# Altium project CAN_Breakout-Board.PrjPcb
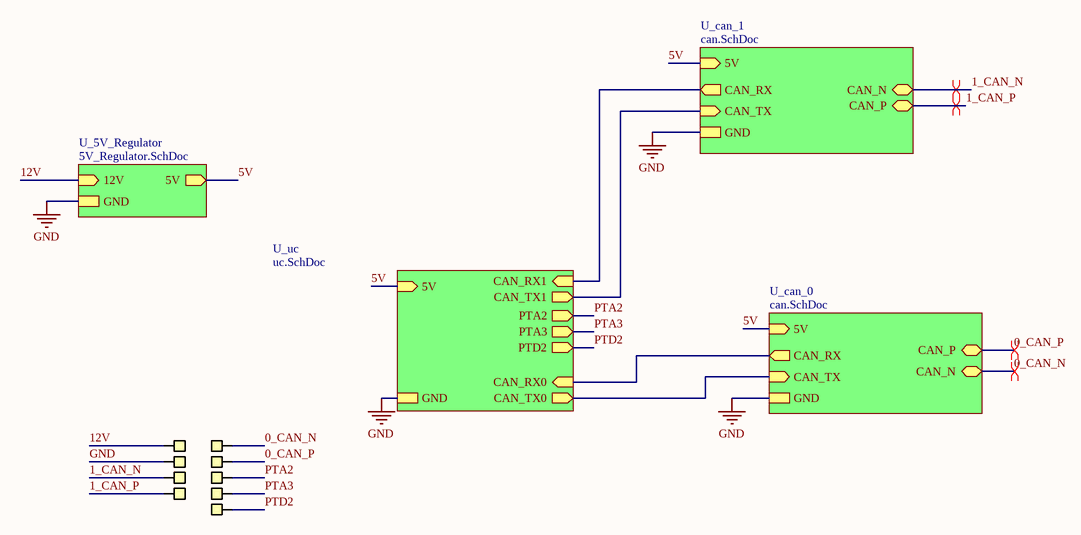
[diagram p0: Top_Level.SchDoc]
4 sheets, 47 parts. Net scope: hierarchical (ports join the sheet entries above them; power ports are global).
Board file: CAN_Breakout-Board.PcbDoc
Sheets:
  Top_Level.SchDoc
    U_5V_Regulator = 5V_Regulator.SchDoc
    U_can_1 = can.SchDoc
    U_uc = uc.SchDoc
    U_can_0 = can.SchDoc

## Sheet Top_Level.SchDoc
size A; SheetNumber: 1; SheetTotal: 4

### Parts
X1  GenericPinHeader(0.1in)  [GenericPinHeader(.1in)]  (value not drawn)
X2  GenericPinHeader(0.1in)  [GenericPinHeader(.1in)]  (value not drawn)
X3  GenericPinHeader(0.1in)  [GenericPinHeader(.1in)]  (value not drawn)
X4  GenericPinHeader(0.1in)  [GenericPinHeader(.1in)]  (value not drawn)
X5  GenericPinHeader(0.1in)  [GenericPinHeader(.1in)]  (value not drawn)
X6  GenericPinHeader(0.1in)  [GenericPinHeader(.1in)]  (value not drawn)
X7  GenericPinHeader(0.1in)  [GenericPinHeader(.1in)]  (value not drawn)
X8  GenericPinHeader(0.1in)  [GenericPinHeader(.1in)]  (value not drawn)
X9  GenericPinHeader(0.1in)  [GenericPinHeader(.1in)]  (value not drawn)

### Sub-sheets
U_5V_Regulator = 5V_Regulator.SchDoc: 5V (out), 12V (in), GND
U_can_0 = can.SchDoc: 5V (in), CAN_P (bidir), CAN_N (bidir), CAN_TX (in), CAN_RX (out), GND
U_can_1 = can.SchDoc: 5V (in), CAN_P (bidir), CAN_N (bidir), CAN_TX (in), CAN_RX (out), GND
U_uc = uc.SchDoc: 5V (in), CAN_TX1 (out), CAN_RX1 (in), CAN_TX0 (out), CAN_RX0 (in), PTA2 (out), PTA3 (out), PTD2 (out), GND

### Nets
GND: X3.1(Pin) ; sheet U_5V_Regulator/GND, sheet U_can_1/GND, sheet U_uc/GND, sheet U_can_0/GND
0_CAN_N: X2.1(Pin) ; sheet U_can_0/CAN_N
0_CAN_P: X4.1(Pin) ; sheet U_can_0/CAN_P
1_CAN_N: X5.1(Pin) ; sheet U_can_1/CAN_N
1_CAN_P: X7.1(Pin) ; sheet U_can_1/CAN_P
5V: sheet U_5V_Regulator/5V, sheet U_can_1/5V, sheet U_uc/5V, sheet U_can_0/5V
12V: X1.1(Pin) ; sheet U_5V_Regulator/12V
PTA2: X6.1(Pin) ; sheet U_uc/PTA2
PTA3: X8.1(Pin) ; sheet U_uc/PTA3
PTD2: X9.1(Pin) ; sheet U_uc/PTD2
NetU2#1_20: sheet U_uc/CAN_TX0, sheet U_can_0/CAN_TX
NetU2#1_21: sheet U_uc/CAN_RX0, sheet U_can_0/CAN_RX
NetU2#1_51: sheet U_can_1/CAN_TX, sheet U_uc/CAN_TX1
NetU2#1_52: sheet U_can_1/CAN_RX, sheet U_uc/CAN_RX1

### Layout directives
differential pair: 0_CAN_N, 0_CAN_P, 1_CAN_N, 1_CAN_P

### Library data of the parts
X1-X9 = GenericPinHeader(0.1in): Generic .1in(2.54mm) pitch pin header

## Sheet 5V_Regulator.SchDoc
size A; SheetNumber: 2; SheetTotal: 4
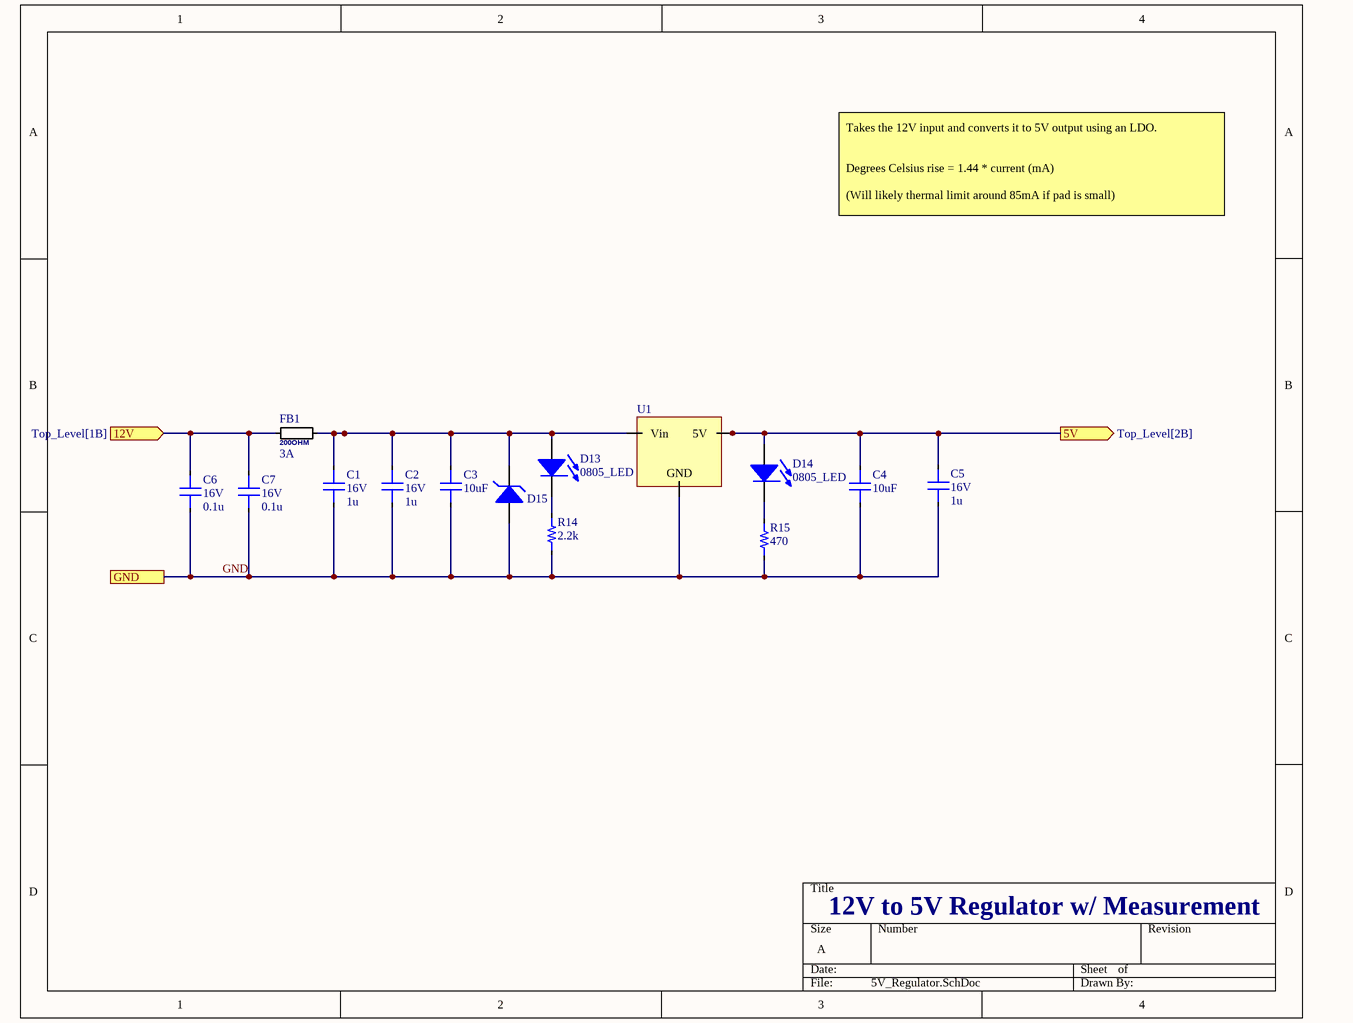
[diagram p1: 5V_Regulator.SchDoc]

### Parts
C1  value 1u  Voltage: 16V  [0603_CAP]  (hidden comment: Capacitor)
C2  value 1u  Voltage: 16V  [0603_CAP]  (hidden comment: Capacitor)
C3  value 10uF  [0603_CAP]  (hidden comment: Capacitor)
C4  value 10uF  [0603_CAP]  (hidden comment: Capacitor)
C5  value 1u  Voltage: 16V  [0603_CAP]  (hidden comment: Capacitor)
C6  value 0.1u  Voltage: 16V  [0603_CAP]  (hidden comment: Capacitor)
C7  value 0.1u  Voltage: 16V  [0603_CAP]  (hidden comment: Capacitor)
D13  0805_LED  [0805_LED]
D14  0805_LED  [0805_LED]
D15  DDZ9701  [SOD-123]  (value not drawn)
FB1  =Z@100MHz: 200OHM  iMax: 3A  [0805_Ferrite]  (hidden comment: *)
R14  value 2.2k  [0603_RES]  (hidden comment: Resistor)
R15  value 470  [0603_RES]  (hidden comment: Resistor)
U1  NCP1117ST50T3G  [SOT-233-4]  (value not drawn)

### Ports
5V (out, see Top_Level[2B]), 12V (in, see Top_Level[1B]), GND

### Nets
GND: C1.1 C2.1 C3.1 C4.1 C5.1 C6.1 C7.1 D15.2(A) R14.1 R15.1 U1.1(GND) ; port GND
5V: C4.2 C5.2 D14.1(A) U1.2(5V) U1.4(Tab) ; port 5V
12V: C6.2 C7.2 FB1.1 ; port 12V
NetC1_2: C1.2 C2.2 C3.2 D13.1(A) D15.1(K) FB1.2 U1.3(Vin)
NetD13_2: D13.2(K) R14.2
NetD14_2: D14.2(K) R15.2

### Notes on the sheet
- Takes the 12V input and converts it to 5V output using an LDO.
  Degrees Celsius rise = 1.44 * current (mA)
  (Will likely thermal limit around 85mA if pad is small)
- 12V to 5V Regulator w/ Measurement
- Title
- Size:
- Date:
- A
- Number:
- Time:
- Revision:
- Sheet
- of
- File:

### Library data of the parts
D13 D14 = 0805_LED: Generic 0805 LED
D15 = DDZ9701: Zener Diode 14V 500mW ±5% Surface Mount SOD-1; Vr: 10.6; Num_Circuits: 1; Package: SOD-123; ComponentLink1Description: Digikey; ComponentLink1URL: https://www.digikey.com/product-detail/en/diodes-incorporated/DDZ9701-7/DDZ9701-7DICT-ND/3877402
FB1 = ChipFerrite: Link: *; MfrPartNo: *; Name: *; Resistance: *; Package: *; Inductance: *
U1 = NCP1117ST50T3G: Vout: 5; Name: NCP1117ST50T3G; Type: Linear fixed; ComponentLink1Description: Digikey; ComponentLink1URL: https://www.digikey.com/product-detail/en/on-semiconductor/NCP1117ST50T3G/NCP1117ST50T3GOSCT-ND/1967217; ComponentLink2Description: Datasheet; ComponentLink2URL: https://www.onsemi.com/pub/Collateral/NCP1117-D.PDF
C1-C7 = Capacitor: Dielectric: *; Percent Tolerance: *; ESR: *
R14 R15 = Resistor: Tolerance: *

## Sheet can.SchDoc: CAN
size A; Organization: Cal Poly Racing; SheetNumber: 3; SheetTotal: 4; engineer1: Graydon Wilson
Used 2 times, as channels U_can_1, U_can_0. Parts and nets are listed once, with the designators drawn on the sheet.
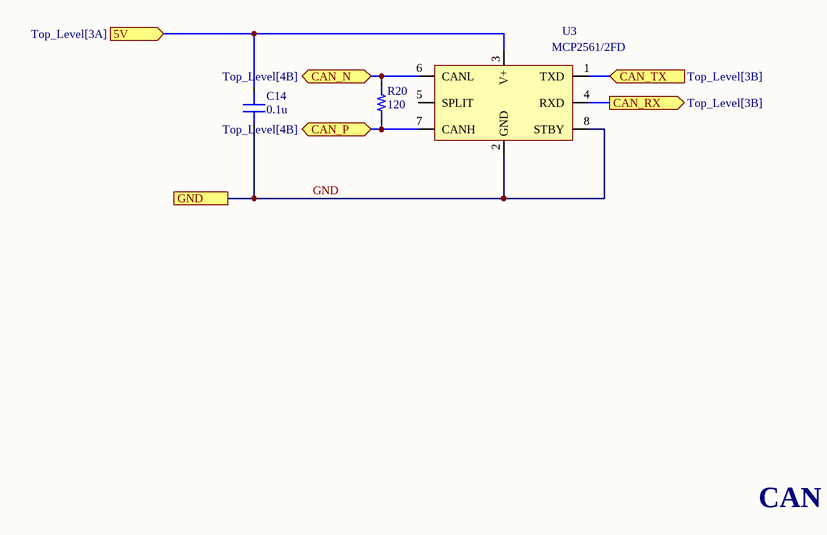
[diagram p2: can.SchDoc]

### Parts
C14  value 0.1u  [0603_CAP]  (hidden comment: Capacitor)
R20  value 120  [0603_RES]  (hidden comment: Resistor)
U3  MCP2561/2FD  [SOIC-8]

### Ports
5V (in, see Top_Level[3A]), CAN_N (bidir, see Top_Level[4B]), CAN_P (bidir, see Top_Level[4B]), CAN_RX (out, see Top_Level[3B]), CAN_TX (in, see Top_Level[3B]), GND

### Nets
5V: C14.1 U3.3(V+) ; port 5V
CAN_N: R20.2 U3.6(CANL) ; port CAN_N
CAN_P: R20.1 U3.7(CANH) ; port CAN_P
CAN_RX: U3.4(RXD) ; port CAN_RX
CAN_TX: U3.1(TXD) ; port CAN_TX
GND: C14.2 U3.2(GND) U3.8(STBY) ; port GND

Not connected (* = marked no-connect by the designer): U3 5(SPLIT)

### Channels
U_can_1: designators C14=C9#1 R20=R4 U3=U3; ports 5V=5V CAN_N=1_CAN_N CAN_P=1_CAN_P CAN_RX=NetU2#1_52 CAN_TX=NetU2#1_51 GND=GND
U_can_0: designators C14=C8#2 R20=R3 U3=U2#2; ports 5V=5V CAN_N=0_CAN_N CAN_P=0_CAN_P CAN_RX=NetU2#1_21 CAN_TX=NetU2#1_20 GND=GND

### Notes on the sheet
- CAN
- Title
- Size:
- Date:
- A
- Number:
- Time:
- Revision:
- Sheet
- of
- File:

### Library data of the parts
U3 = MCP2561/2FD: 1/1 Transceiver CANbus; Vcc: 5; Name: MCP2561/2FD; Type: CAN; ComponentLink1Description: Digikey; ComponentLink1URL: https://www.digikey.com/product-detail/en/microchip-technology/MCP2561FDT-E-SN/MCP2561FDT-E-SNCT-ND/8637243; ComponentLink2Description: Datasheet; ComponentLink2URL: http://ww1.microchip.com/downloads/en/DeviceDoc/20005284A.pdf
R20 = Resistor: Tolerance: *

## Sheet uc.SchDoc: Controller
size A; Organization: Cal Poly Racing; SheetNumber: 4; SheetTotal: 4; engineer1: Graydon Wilson
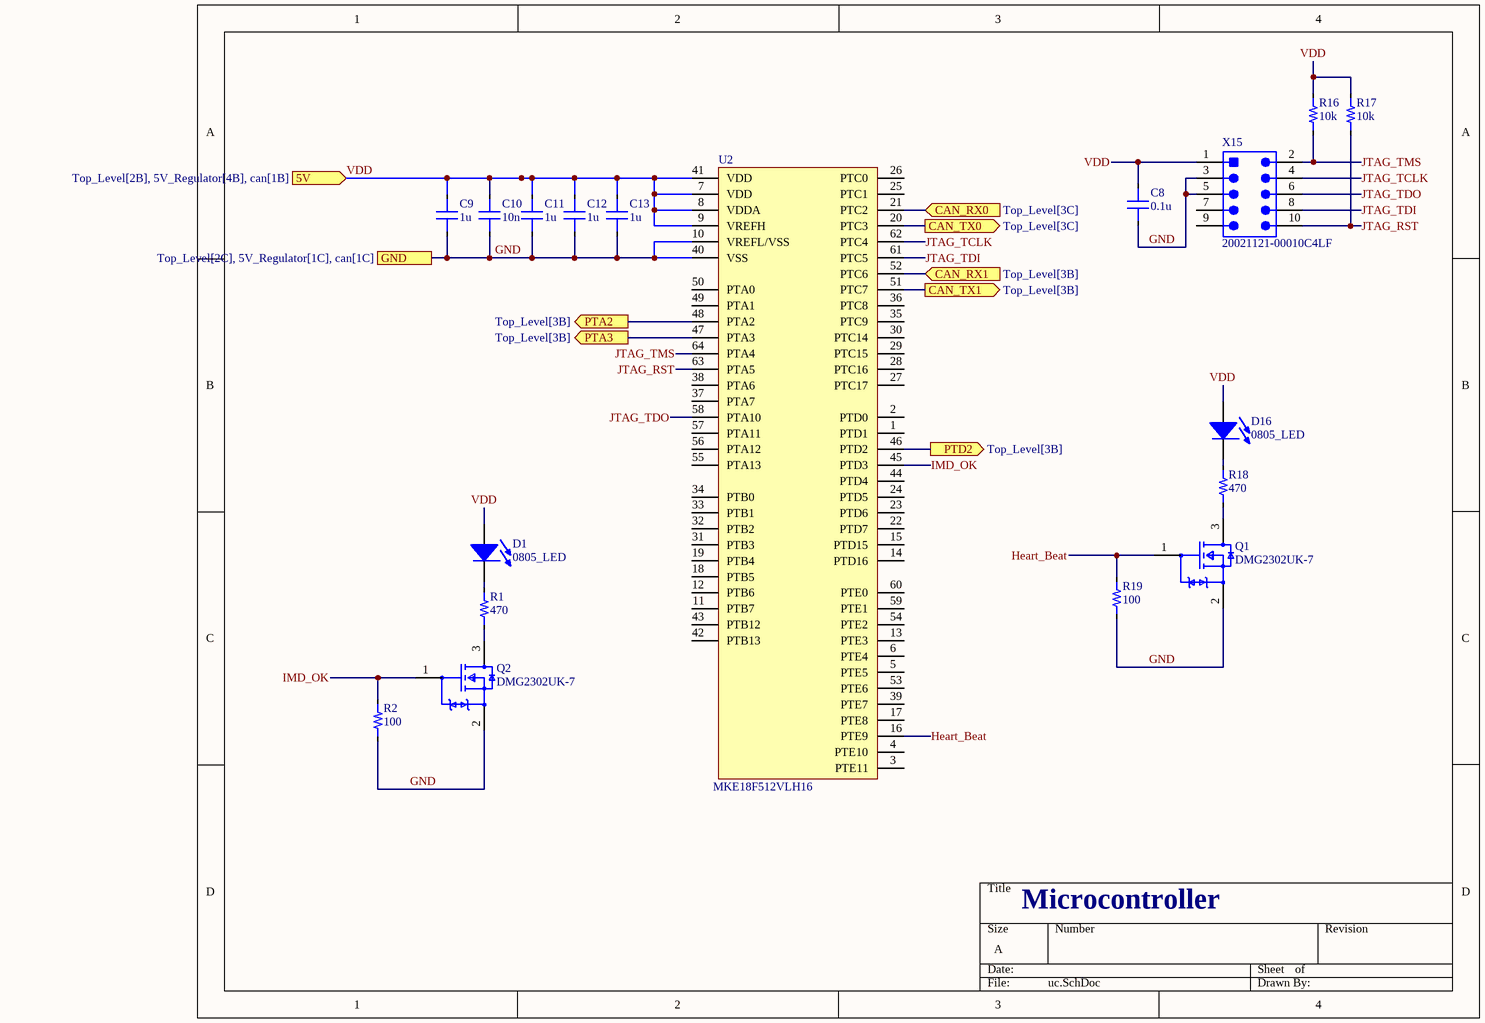
[diagram p3: uc.SchDoc]

### Parts
(Parts that share a designator on the sheet are numbered #1, #2 ... from top to bottom, then left to right.)
C8#1  value 0.1u  [0603_CAP]  (hidden comment: Capacitor)
C9#2  value 1u  [0603_CAP]  (hidden comment: Capacitor)
C10  value 10n  [0603_CAP]  (hidden comment: Capacitor)
C11  value 1u  [0603_CAP]  (hidden comment: Capacitor)
C12  value 1u  [0603_CAP]  (hidden comment: Capacitor)
C13  value 1u  [0603_CAP]  (hidden comment: Capacitor)
D1  0805_LED  [0805_LED]
D16  0805_LED  [0805_LED]
Q1  DMG2302UK-7  [SOT23-3]
Q2  DMG2302UK-7  [SOT23-3]
R1  value 470  [0603_RES]  (hidden comment: Resistor)
R2  value 100  [0603_RES]  (hidden comment: Resistor)
R16  value 10k  [0603_RES]  (hidden comment: Resistor)
R17  value 10k  [0603_RES]  (hidden comment: Resistor)
R18  value 470  [0603_RES]  (hidden comment: Resistor)
R19  value 100  [0603_RES]  (hidden comment: Resistor)
U2#1  MKE18F512VLH16  [TQFP64]
X15  20021121-00010C4LF  [HDR2X5_SMT]

### Ports
5V (in, see Top_Level[2B], 5V_Regulator[4B], can[1B]), CAN_RX0 (in, see Top_Level[3C]), CAN_RX1 (in, see Top_Level[3B]), CAN_TX0 (out, see Top_Level[3C]), CAN_TX1 (out, see Top_Level[3B]), GND (see Top_Level[2C], 5V_Regulator[1C], can[1C]), PTA2 (out, see Top_Level[3B]), PTA3 (out, see Top_Level[3B]), PTD2 (out, see Top_Level[3B])

### Nets
GND: C8#1.1 C9#2.1 C10.1 C11.1 C12.1 C13.1 Q1.2(S) Q2.2(S) R2.1 R19.1 U2#1.10(VREFL/VSS) U2#1.40(VSS) X15.3 X15.5 ; port GND
Heart_Beat: Q1.1(G) R19.2 U2#1.16(PTE9)
IMD_OK: Q2.1(G) R2.2 U2#1.45(PTD3)
JTAG_RST: R17.1 U2#1.63(PTA5) X15.10
JTAG_TCLK: U2#1.62(PTC4) X15.4
JTAG_TDI: U2#1.61(PTC5) X15.8
JTAG_TDO: U2#1.58(PTA10) X15.6
JTAG_TMS: R16.1 U2#1.64(PTA4) X15.2
PTA2: U2#1.48(PTA2) ; port PTA2
PTA3: U2#1.47(PTA3) ; port PTA3
PTD2: U2#1.46(PTD2) ; port PTD2
VDD: C8#1.2 C9#2.2 C10.2 C11.2 C12.2 C13.2 D1.1(A) D16.1(A) R16.2 R17.2 U2#1.7(VDD) U2#1.8(VDDA) U2#1.9(VREFH) U2#1.41(VDD) X15.1 ; port 5V  [project net 5V]
NetD1_2: D1.2(K) R1.2
NetD16_2: D16.2(K) R18.2
NetQ1_3: Q1.3(D) R18.1
NetQ2_3: Q2.3(D) R1.1
NetU2#1_20: U2#1.20(PTC3) ; port CAN_TX0
NetU2#1_21: U2#1.21(PTC2) ; port CAN_RX0
NetU2#1_51: U2#1.51(PTC7) ; port CAN_TX1
NetU2#1_52: U2#1.52(PTC6) ; port CAN_RX1

Not connected (* = marked no-connect by the designer): U2#1 1(PTD1) 2(PTD0) 3(PTE11) 4(PTE10) 5(PTE5) 6(PTE4) 11(PTB7) 12(PTB6) 13(PTE3) 14(PTD16) 15(PTD15) 17(PTE8) 18(PTB5) 19(PTB4) 22(PTD7) 23(PTD6) 24(PTD5) 25(PTC1) 26(PTC0) 27(PTC17) 28(PTC16) 29(PTC15) 30(PTC14) 31(PTB3) 32(PTB2) 33(PTB1) 34(PTB0) 35(PTC9) 36(PTC8) 37(PTA7) 38(PTA6) 39(PTE7) 42(PTB13) 43(PTB12) 44(PTD4) 49(PTA1) 50(PTA0) 53(PTE6) 54(PTE2) 55(PTA13) 56(PTA12) 57(PTA11) 59(PTE1) 60(PTE0); X15 7 9

### Notes on the sheet
- Microcontroller
- Title
- Size:
- Date:
- A
- Number:
- Time:
- Revision:
- Sheet
- of
- File:

### Library data of the parts
D1 D16 = 0805_LED: Generic 0805 LED
Q1 Q2 = DMG2302UK-7: MOSFET N-CH 20V 2.8A SOT23; Manufacturer: Diodes Inc.; Reverse Recovery Time: 5.3ns; Gate Charge At Vgs: 2.8nC @ 10V; Turn On Delay Time: 0.6ns; Pulse Drain Current: 12A; Max Forward Diode Voltage: 1.2V; Reverse Recovery Charge: 0.5nC; Automotive Grade: Grade 0; Threshold Vgs Min: 0.3V; Number Of N Channels: 1; Standoff Height: 0.013mm; Typ Forward Diode Voltage: 0.7V; Drain To Source Resistance: 61mΩ; Rthja Max: 192°C/W; Max Junction Temp: +150°C; Input Capacitace At Vds: 130pF @ 10V; Threshold Vgs Max: 1V; Turn Off Delay Time: 4.2ns; Depletion Mode: False; Gate To Source Voltage: 12V; Power Dissipation: 0.66W; Device Class L1: Discrete Semiconductors; Footprint Url: https://www.diodes.com/assets/Package-Files/SOT23.pdf; Lead Free: Yes; Manufacturer Part Number: DMG2302UK-7; Temperature Range High: +150°C; Drain To Source Voltage: 20V; Category: Trans; Digikey Description: MOSFET N-CH 20V 2.8A SOT23; RoHS: TRUE; Device Class L2: Transistors; Height: 1.1mm; Automotive: Yes; Package: SOT23; Drain To Source Breakdown Voltage: 20V; Continuous Drain Current: 2.8A; ComponentLink2Description: Datasheet; Device Class L3: MOSFETs; Octopart: https://octopart.com/dmg2302uk-7-diodes+inc.-73850182; Temperature Range Low: -55°C; Temperature: -55°C to +150°C; Number Of Channels: 1; ComponentLink2URL: https://www.diodes.com/assets/Datasheets/DMG2302UK.pdf
U2#1 = MKE18F512VLH16: Vcc: 2.7-5.5; Package: TQFP64
X15 = 20021121-00010C4LF: Header, 10-Leads, Body 3.43x6.35mm, Pitch 1.27mm; Circuits: 10; Name: 20021121-00010C4LF; ComponentLink1Description: Digikey; ComponentLink1URL: https://www.digikey.com/product-detail/en/amphenol-icc-fci/20021121-00010C4LF/609-3695-1-ND/2209147
C8-C13 = Capacitor: Dielectric: *; Percent Tolerance: *; ESR: *
R1 R2 R16-R19 = Resistor: Tolerance: *

## Nets that join several sheets
GND: Top_Level (X3.1), 5V_Regulator (11 pins), U_can_1 (C9#1.2 U3.2 U3.8), uc (14 pins), U_can_0 (C8#2.2 U2#2.2 U2#2.8)
0_CAN_N: Top_Level (X2.1), U_can_0 (R3.2 U2#2.6)
0_CAN_P: Top_Level (X4.1), U_can_0 (R3.1 U2#2.7)
1_CAN_N: Top_Level (X5.1), U_can_1 (R4.2 U3.6)
1_CAN_P: Top_Level (X7.1), U_can_1 (R4.1 U3.7)
5V: 5V_Regulator (5 pins), U_can_1 (C9#1.1 U3.3), uc (15 pins), U_can_0 (C8#2.1 U2#2.3)
12V: Top_Level (X1.1), 5V_Regulator (C6.2 C7.2 FB1.1)
NetU2#1_20: uc (U2#1.20), U_can_0 (U2#2.1)
NetU2#1_21: uc (U2#1.21), U_can_0 (U2#2.4)
NetU2#1_51: U_can_1 (U3.1), uc (U2#1.51)
NetU2#1_52: U_can_1 (U3.4), uc (U2#1.52)
PTA2: Top_Level (X6.1), uc (U2#1.48)
PTA3: Top_Level (X8.1), uc (U2#1.47)
PTD2: Top_Level (X9.1), uc (U2#1.46)